# EAGLE design FenixCasePowerBoard (EAGLE 7.7.0)

## Sheet 1 of 3
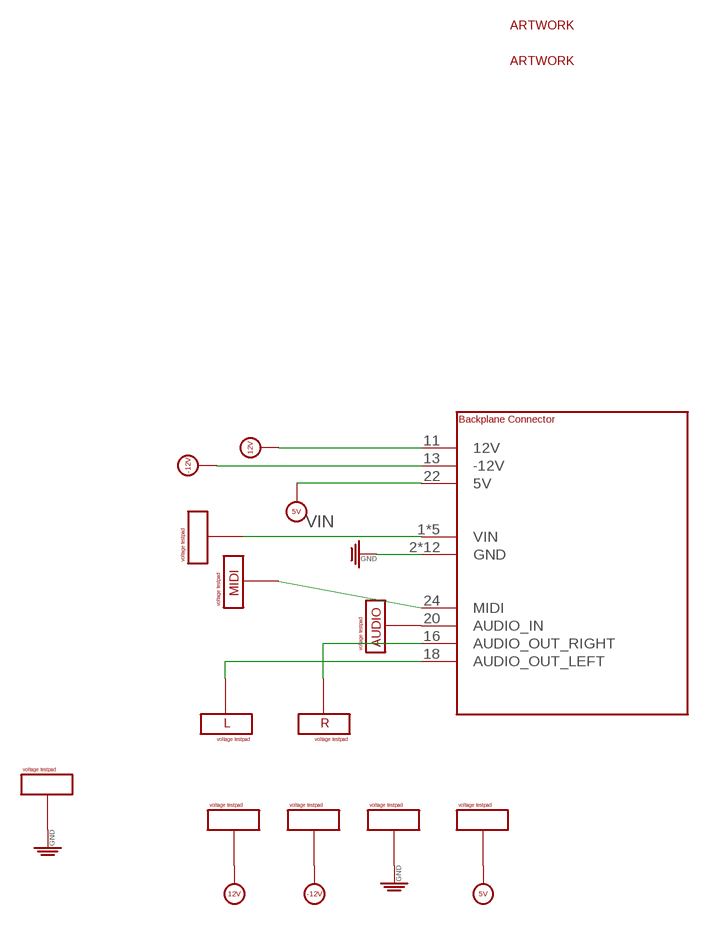
[diagram p0: schematic, sheet 1]

### Parts
U$1  VOLTAGETESTPAD  [POWERTESTPAD]
U$2  VOLTAGETESTPAD  [POWERTESTPAD]
U$4  VOLTAGETESTPAD_BIG  [POWERTESTPAD_BIG]
U$6  VOLTAGETESTPAD_BIG  [POWERTESTPAD_BIG]
U$7  VOLTAGETESTPAD_BIG  [POWERTESTPAD_BIG]
U$8  BACKPLANECONNECTOR_VINPLANE  [BACKPLANECONNECTOR]
U$12  VOLTAGETESTPAD_BIG  [POWERTESTPAD_BIG]
U$20  TINRS_ARTWORKTINYDATE  [JUSTATINYROCKET_DATECODE]
U$21  TINRS_ARTWORKTINYDATE  [JUSTATINYROCKET_DATECODE]
U$29  VOLTAGETESTPAD  [POWERTESTPAD]
U$30  VOLTAGETESTPAD  [POWERTESTPAD]
U$104  VOLTAGETESTPAD_BIG  [POWERTESTPAD_BIG]
U$105  VOLTAGETESTPAD_BIG  [POWERTESTPAD_BIG]

### Nets
5V [power]: U$7.P$1(VOLTAGE) U$7.P$2(VOLTAGE) U$7.P$3(VOLTAGE) U$8.22(5V) ; also sheet 3
12V [power]: U$8.11(12V) U$12.P$1(VOLTAGE) U$12.P$2(VOLTAGE) U$12.P$3(VOLTAGE) ; also sheet 3
-12V [power]: U$4.P$1(VOLTAGE) U$4.P$2(VOLTAGE) U$4.P$3(VOLTAGE) U$8.13(-12V) ; also sheet 3
AUDIO_OUT_LEFT_TIP: U$8.18(AUDIO_OUT_LEFT) U$29.P$1(VOLTAGE) U$29.P$2(VOLTAGE) U$29.P$3(VOLTAGE)
AUDIO_OUT_RIGHT_TIP: U$8.16(AUDIO_OUT_RIGHT) U$30.P$1(VOLTAGE) U$30.P$2(VOLTAGE) U$30.P$3(VOLTAGE)
GND [power]: U$6.P$1(VOLTAGE) U$6.P$2(VOLTAGE) U$6.P$3(VOLTAGE) U$8.2(GND) U$8.4(GND) U$8.6(GND) U$8.8(GND) U$8.10(GND) U$8.12(GND) U$8.14(GND) U$8.15(GND) U$8.17(GND) U$8.19(GND) U$8.21(GND) U$8.23(GND) U$105.P$1(VOLTAGE) U$105.P$2(VOLTAGE) U$105.P$3(VOLTAGE) ; also sheet 3
N$1: U$1.P$1(VOLTAGE) U$1.P$2(VOLTAGE) U$1.P$3(VOLTAGE) U$8.24(MIDI)
N$2: U$2.P$1(VOLTAGE) U$2.P$2(VOLTAGE) U$2.P$3(VOLTAGE) U$8.20(AUDIO_IN)
VIN [power]: U$8.1(VIN) U$8.3(VIN) U$8.5(VIN) U$8.7(VIN) U$8.9(VIN) U$104.P$1(VOLTAGE) U$104.P$2(VOLTAGE) U$104.P$3(VOLTAGE) ; also sheet 3

## Sheet 2 of 3: Serial Lines

## Sheet 3 of 3: Power
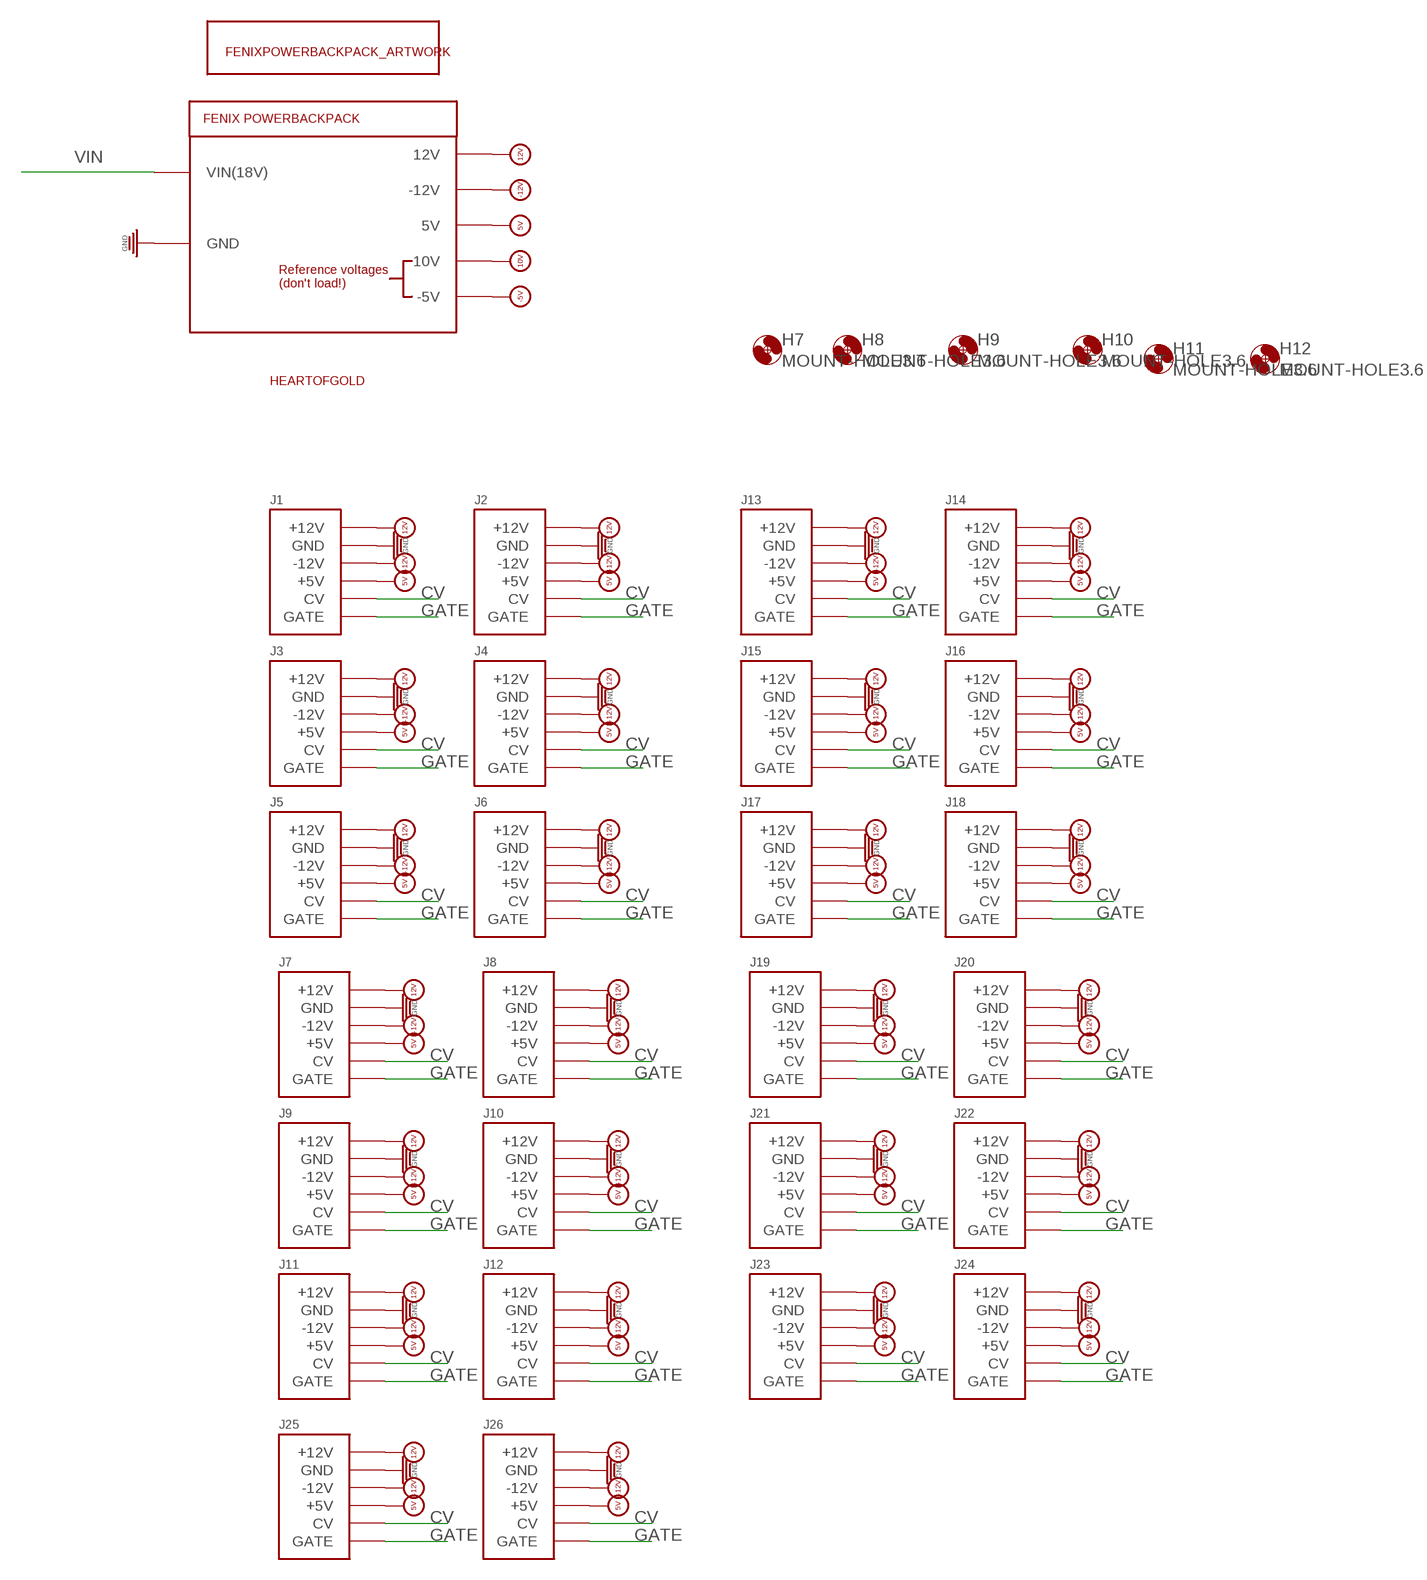
[diagram p1: schematic, sheet 3]

### Parts
H7  MOUNT-HOLE3.6  [3,6]
H8  MOUNT-HOLE3.6  [3,6]
H9  MOUNT-HOLE3.6  [3,6]
H10  MOUNT-HOLE3.6  [3,6]
H11  MOUNT-HOLE3.6  [3,6]
H12  MOUNT-HOLE3.6  [3,6]
J1  POWERSHROUDED  [POWER_16_SHROUDED]
J2  POWERSHROUDED  [POWER_16_SHROUDED]
J3  POWERSHROUDED  [POWER_16_SHROUDED]
J4  POWERSHROUDED  [POWER_16_SHROUDED]
J5  POWERSHROUDED  [POWER_16_SHROUDED]
J6  POWERSHROUDED  [POWER_16_SHROUDED]
J7  POWERSHROUDED  [POWER_16_SHROUDED]
J8  POWERSHROUDED  [POWER_16_SHROUDED]
J9  POWERSHROUDED  [POWER_16_SHROUDED]
J10  POWERSHROUDED  [POWER_16_SHROUDED]
J11  POWERSHROUDED  [POWER_16_SHROUDED]
J12  POWERSHROUDED  [POWER_16_SHROUDED]
J13  POWERSHROUDED  [POWER_16_SHROUDED]
J14  POWERSHROUDED  [POWER_16_SHROUDED]
J15  POWERSHROUDED  [POWER_16_SHROUDED]
J16  POWERSHROUDED  [POWER_16_SHROUDED]
J17  POWERSHROUDED  [POWER_16_SHROUDED]
J18  POWERSHROUDED  [POWER_16_SHROUDED]
J19  POWERSHROUDED  [POWER_16_SHROUDED]
J20  POWERSHROUDED  [POWER_16_SHROUDED]
J21  POWERSHROUDED  [POWER_16_SHROUDED]
J22  POWERSHROUDED  [POWER_16_SHROUDED]
J23  POWERSHROUDED  [POWER_16_SHROUDED]
J24  POWERSHROUDED  [POWER_16_SHROUDED]
J25  POWERSHROUDED  [POWER_16_SHROUDED]
J26  POWERSHROUDED  [POWER_16_SHROUDED]
U$5  FENIXPOWERBACKPACKART_MODULE  [FENIXPOWERBACKPACK_MODULE]
U$10  HEARTOFGOLD  [HEARTOFGOLD]
U$31  FENIXPOWERBACKPACK_MODULE  [FENIXPOWERBACKPACK]

### Nets
5V [power]: J1.11(+5V) J1.12(+5V) J2.11(+5V) J2.12(+5V) J3.11(+5V) J3.12(+5V) J4.11(+5V) J4.12(+5V) J5.11(+5V) J5.12(+5V) J6.11(+5V) J6.12(+5V) J7.11(+5V) J7.12(+5V) J8.11(+5V) J8.12(+5V) J9.11(+5V) J9.12(+5V) J10.11(+5V) J10.12(+5V) J11.11(+5V) J11.12(+5V) J12.11(+5V) J12.12(+5V) J13.11(+5V) J13.12(+5V) J14.11(+5V) J14.12(+5V) J15.11(+5V) J15.12(+5V) J16.11(+5V) J16.12(+5V) J17.11(+5V) J17.12(+5V) J18.11(+5V) J18.12(+5V) J19.11(+5V) J19.12(+5V) J20.11(+5V) J20.12(+5V) J21.11(+5V) J21.12(+5V) J22.11(+5V) J22.12(+5V) J23.11(+5V) J23.12(+5V) J24.11(+5V) J24.12(+5V) J25.11(+5V) J25.12(+5V) J26.11(+5V) J26.12(+5V) U$31.5V@1(5V) U$31.5V@2(5V) U$31.5V@3(5V) U$31.5V@4(5V) ; also sheet 1
10V [power]: U$31.10V U$31.10V@2(10V)
12V [power]: J1.9(+12V) J1.10(+12V) J2.9(+12V) J2.10(+12V) J3.9(+12V) J3.10(+12V) J4.9(+12V) J4.10(+12V) J5.9(+12V) J5.10(+12V) J6.9(+12V) J6.10(+12V) J7.9(+12V) J7.10(+12V) J8.9(+12V) J8.10(+12V) J9.9(+12V) J9.10(+12V) J10.9(+12V) J10.10(+12V) J11.9(+12V) J11.10(+12V) J12.9(+12V) J12.10(+12V) J13.9(+12V) J13.10(+12V) J14.9(+12V) J14.10(+12V) J15.9(+12V) J15.10(+12V) J16.9(+12V) J16.10(+12V) J17.9(+12V) J17.10(+12V) J18.9(+12V) J18.10(+12V) J19.9(+12V) J19.10(+12V) J20.9(+12V) J20.10(+12V) J21.9(+12V) J21.10(+12V) J22.9(+12V) J22.10(+12V) J23.9(+12V) J23.10(+12V) J24.9(+12V) J24.10(+12V) J25.9(+12V) J25.10(+12V) J26.9(+12V) J26.10(+12V) U$31.12V@1(12V) U$31.12V@2(12V) U$31.12V@4(12V) ; also sheet 1
-5V [power]: U$31.-5V U$31.-5V@2(-5V)
-12V [power]: J1.1(-12V) J1.2(-12V) J2.1(-12V) J2.2(-12V) J3.1(-12V) J3.2(-12V) J4.1(-12V) J4.2(-12V) J5.1(-12V) J5.2(-12V) J6.1(-12V) J6.2(-12V) J7.1(-12V) J7.2(-12V) J8.1(-12V) J8.2(-12V) J9.1(-12V) J9.2(-12V) J10.1(-12V) J10.2(-12V) J11.1(-12V) J11.2(-12V) J12.1(-12V) J12.2(-12V) J13.1(-12V) J13.2(-12V) J14.1(-12V) J14.2(-12V) J15.1(-12V) J15.2(-12V) J16.1(-12V) J16.2(-12V) J17.1(-12V) J17.2(-12V) J18.1(-12V) J18.2(-12V) J19.1(-12V) J19.2(-12V) J20.1(-12V) J20.2(-12V) J21.1(-12V) J21.2(-12V) J22.1(-12V) J22.2(-12V) J23.1(-12V) J23.2(-12V) J24.1(-12V) J24.2(-12V) J25.1(-12V) J25.2(-12V) J26.1(-12V) J26.2(-12V) U$31.-12V@1(-12V) U$31.-12V@2(-12V) U$31.-12V@3(-12V) ; also sheet 1
CV: J1.13(CV) J1.14(CV) J2.13(CV) J2.14(CV) J3.13(CV) J3.14(CV) J4.13(CV) J4.14(CV) J5.13(CV) J5.14(CV) J6.13(CV) J6.14(CV) J7.13(CV) J7.14(CV) J8.13(CV) J8.14(CV) J9.13(CV) J9.14(CV) J10.13(CV) J10.14(CV) J11.13(CV) J11.14(CV) J12.13(CV) J12.14(CV) J13.13(CV) J13.14(CV) J14.13(CV) J14.14(CV) J15.13(CV) J15.14(CV) J16.13(CV) J16.14(CV) J17.13(CV) J17.14(CV) J18.13(CV) J18.14(CV) J19.13(CV) J19.14(CV) J20.13(CV) J20.14(CV) J21.13(CV) J21.14(CV) J22.13(CV) J22.14(CV) J23.13(CV) J23.14(CV) J24.13(CV) J24.14(CV) J25.13(CV) J25.14(CV) J26.13(CV) J26.14(CV)
GATE: J1.15(GATE) J1.16(GATE) J2.15(GATE) J2.16(GATE) J3.15(GATE) J3.16(GATE) J4.15(GATE) J4.16(GATE) J5.15(GATE) J5.16(GATE) J6.15(GATE) J6.16(GATE) J7.15(GATE) J7.16(GATE) J8.15(GATE) J8.16(GATE) J9.15(GATE) J9.16(GATE) J10.15(GATE) J10.16(GATE) J11.15(GATE) J11.16(GATE) J12.15(GATE) J12.16(GATE) J13.15(GATE) J13.16(GATE) J14.15(GATE) J14.16(GATE) J15.15(GATE) J15.16(GATE) J16.15(GATE) J16.16(GATE) J17.15(GATE) J17.16(GATE) J18.15(GATE) J18.16(GATE) J19.15(GATE) J19.16(GATE) J20.15(GATE) J20.16(GATE) J21.15(GATE) J21.16(GATE) J22.15(GATE) J22.16(GATE) J23.15(GATE) J23.16(GATE) J24.15(GATE) J24.16(GATE) J25.15(GATE) J25.16(GATE) J26.15(GATE) J26.16(GATE)
GND [power]: J1.3(GND) J1.4(GND) J1.5(GND) J1.6(GND) J1.7(GND) J1.8(GND) J2.3(GND) J2.4(GND) J2.5(GND) J2.6(GND) J2.7(GND) J2.8(GND) J3.3(GND) J3.4(GND) J3.5(GND) J3.6(GND) J3.7(GND) J3.8(GND) J4.3(GND) J4.4(GND) J4.5(GND) J4.6(GND) J4.7(GND) J4.8(GND) J5.3(GND) J5.4(GND) J5.5(GND) J5.6(GND) J5.7(GND) J5.8(GND) J6.3(GND) J6.4(GND) J6.5(GND) J6.6(GND) J6.7(GND) J6.8(GND) J7.3(GND) J7.4(GND) J7.5(GND) J7.6(GND) J7.7(GND) J7.8(GND) J8.3(GND) J8.4(GND) J8.5(GND) J8.6(GND) J8.7(GND) J8.8(GND) J9.3(GND) J9.4(GND) J9.5(GND) J9.6(GND) J9.7(GND) J9.8(GND) J10.3(GND) J10.4(GND) J10.5(GND) J10.6(GND) J10.7(GND) J10.8(GND) J11.3(GND) J11.4(GND) J11.5(GND) J11.6(GND) J11.7(GND) J11.8(GND) J12.3(GND) J12.4(GND) J12.5(GND) J12.6(GND) J12.7(GND) J12.8(GND) J13.3(GND) J13.4(GND) J13.5(GND) J13.6(GND) J13.7(GND) J13.8(GND) J14.3(GND) J14.4(GND) J14.5(GND) J14.6(GND) J14.7(GND) J14.8(GND) J15.3(GND) J15.4(GND) J15.5(GND) J15.6(GND) J15.7(GND) J15.8(GND) J16.3(GND) J16.4(GND) J16.5(GND) J16.6(GND) J16.7(GND) J16.8(GND) J17.3(GND) J17.4(GND) J17.5(GND) J17.6(GND) J17.7(GND) J17.8(GND) J18.3(GND) J18.4(GND) J18.5(GND) J18.6(GND) J18.7(GND) J18.8(GND) J19.3(GND) J19.4(GND) J19.5(GND) J19.6(GND) J19.7(GND) J19.8(GND) J20.3(GND) J20.4(GND) J20.5(GND) J20.6(GND) J20.7(GND) J20.8(GND) J21.3(GND) J21.4(GND) J21.5(GND) J21.6(GND) J21.7(GND) J21.8(GND) J22.3(GND) J22.4(GND) J22.5(GND) J22.6(GND) J22.7(GND) J22.8(GND) J23.3(GND) J23.4(GND) J23.5(GND) J23.6(GND) J23.7(GND) J23.8(GND) J24.3(GND) J24.4(GND) J24.5(GND) J24.6(GND) J24.7(GND) J24.8(GND) J25.3(GND) J25.4(GND) J25.5(GND) J25.6(GND) J25.7(GND) J25.8(GND) J26.3(GND) J26.4(GND) J26.5(GND) J26.6(GND) J26.7(GND) J26.8(GND) U$31.GND@1(GND) U$31.GND@2(GND) U$31.GND@3(GND) U$31.GND@4(GND) U$31.GND@5(GND) U$31.GND@6(GND) U$31.GND@7(GND) U$31.GND@8(GND) U$31.GND@9(GND) U$31.GND@10(GND) U$31.GND@11(GND) U$31.GND@12(GND) U$31.GND@13(GND) U$31.GND@14(GND) ; also sheet 1
VIN [power]: U$31.VIN@1(VIN(18V)) U$31.VIN@2(VIN(18V)) U$31.VIN@3(VIN(18V)) U$31.VIN@4(VIN(18V)) ; also sheet 1

## Library data of the parts
H7-H12 = zephod-components:MOUNT-HOLE: MOUNTING HOLE with drill center marker
J1-J26 = EurorackModularParts:POWER
U$1 = FenixBase:VOLTAGETESTPAD; DESC: MIDI
U$2 = FenixBase:VOLTAGETESTPAD; DESC: AUDIO
U$4 = FenixBase:VOLTAGETESTPAD; DESC: -12V
U$5 = EurorackModularParts:FENIXPOWERBACKPACKART
U$6 U$105 = FenixBase:VOLTAGETESTPAD; DESC: GND
U$7 = FenixBase:VOLTAGETESTPAD; DESC: 5V
U$8 = FenixBase:BACKPLANECONNECTOR_VIN; DESC: PowerSupplyInput
U$10 = FenixBase:HEARTOFGOLD
U$12 = FenixBase:VOLTAGETESTPAD; DESC: 12V
U$20 U$21 = EurorackModularParts:TINRS_ARTWORK
U$29 = FenixBase:VOLTAGETESTPAD; DESC: L
U$30 = FenixBase:VOLTAGETESTPAD; DESC: R
U$31 = EurorackModularParts:FENIXPOWERBACKPACK
U$104 = FenixBase:VOLTAGETESTPAD; DESC: VIN

## Net classes
0 default: width 0.254 mm
1 power: width 1.27 mm, clearance 0.203 mm

## Board
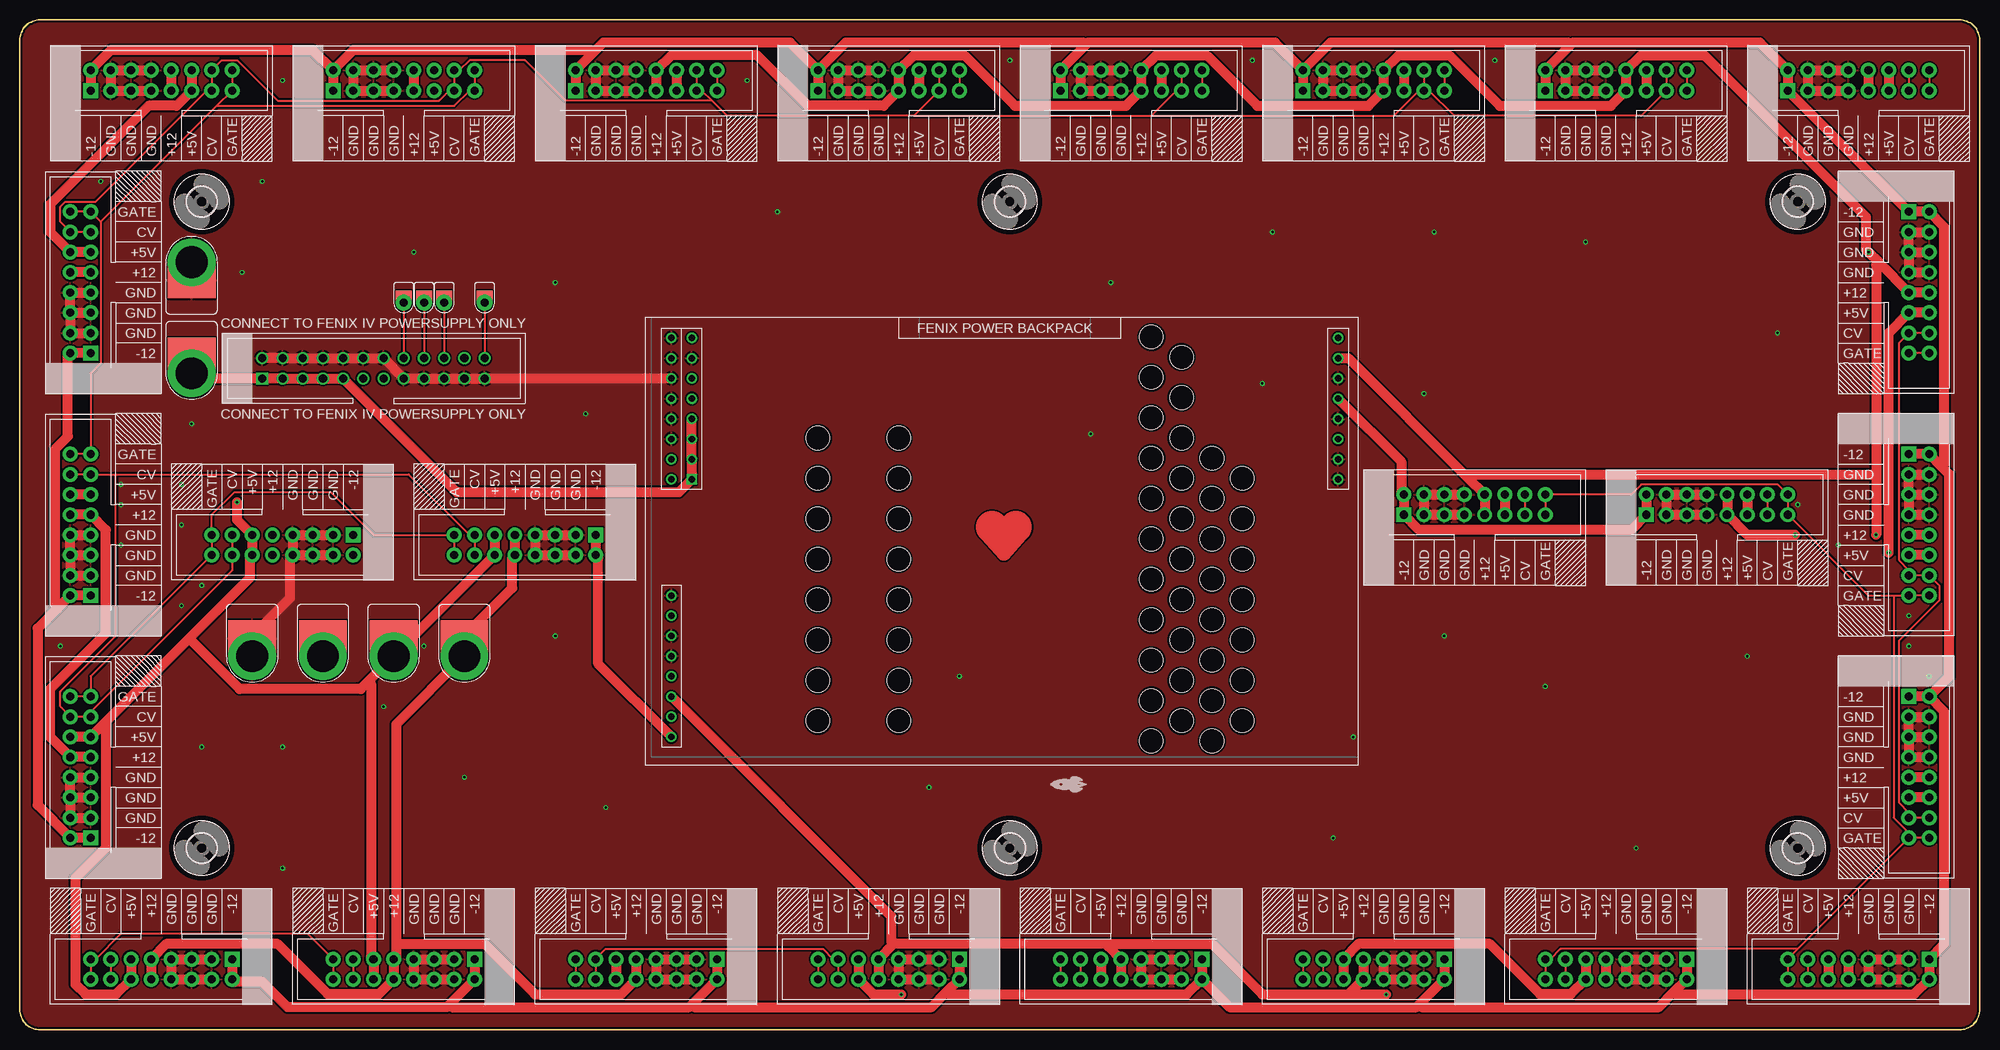
[diagram p2: board, top side]
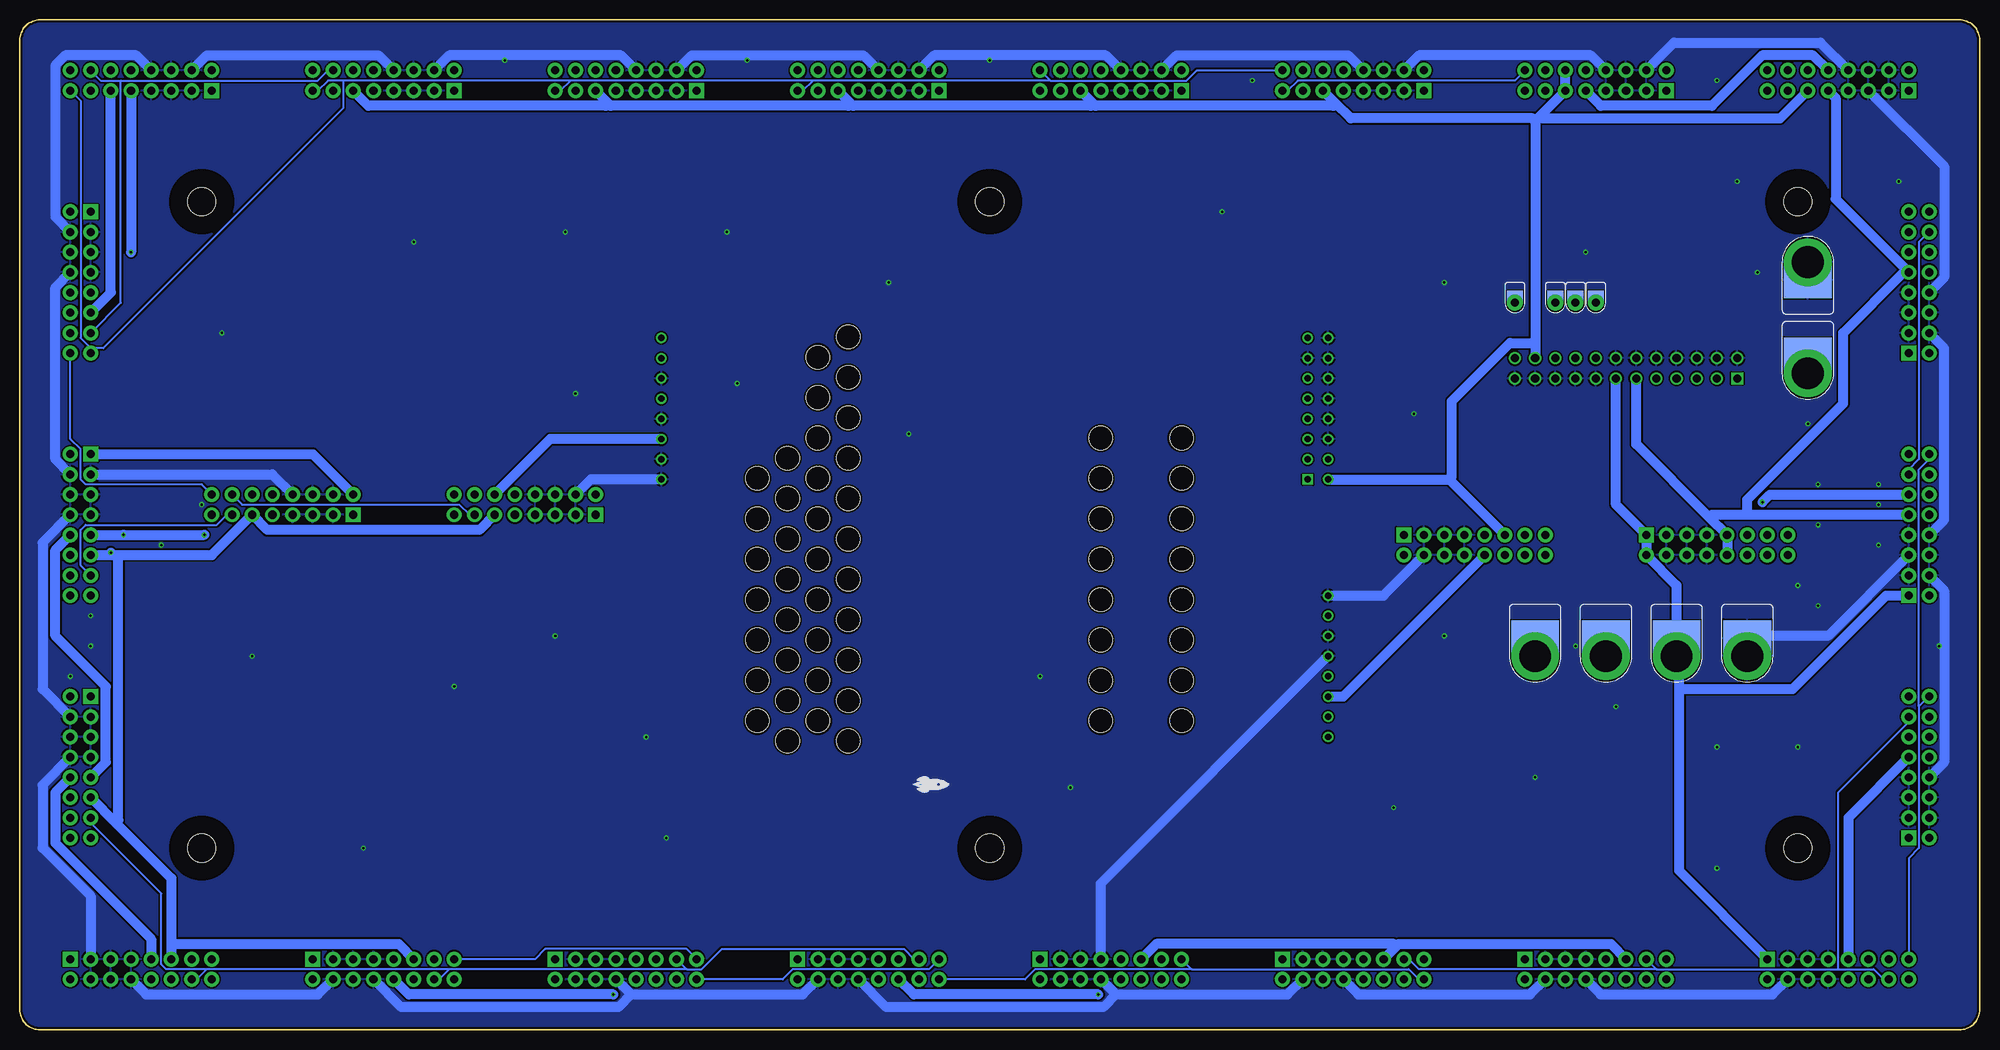
[diagram p3: board, bottom side, seen from below]

Size 246.38 x 127 mm. Coordinates in mm from the lower left corner, seen from the top.
Outline: 246.38,2.54 246.38,124.46 arc90 243.84,127 2.54,127 arc90 0,124.46 0,2.54 arc90 2.54,0 243.84,0 arc90 246.38,2.54
Copper layers (1*16): Top 0.035mm / dielectric 1.5mm / Bottom 0.035mm
Design rules "ITEADstudio_DRC *": minimum track width 6mil, minimum drill 12mil, track to track 6mil, track to pad 6mil, pad to pad 6mil, via to via 6mil, smd to smd 0mil, copper to edge 10mil, drill to drill 10mil, minimum pad ring 10mil, minimum via ring 6mil, stop-mask expansion 2mil, vias tented up to drill 100mil, thermal gap 10mil
Holes 3 mm at 153.67,64.26 149.86,61.72 149.86,56.64 142.24,51.56 153.67,59.18 153.67,54.1 153.67,49.02 149.86,46.48 146.05,54.1 149.86,51.56 142.24,46.48 146.05,49.02 146.05,59.18 146.05,64.26 142.24,61.72 142.24,56.64 100.33,74.42 100.33,69.34 100.33,64.26 110.49,74.42 110.49,69.34 110.49,64.26 110.49,49.02 110.49,43.94 110.49,38.86 100.33,49.02 100.33,43.94 100.33,38.86 149.86,66.8 142.24,66.8 146.05,69.34 142.24,71.88 142.24,76.96 142.24,82.04 142.24,87.12 146.05,74.42 146.05,79.5 146.05,84.58 153.67,43.94 153.67,38.86 149.86,41.4 146.05,43.94 142.24,41.4 146.05,38.86 149.86,36.32 142.24,36.32 149.86,71.88 153.67,69.34 110.49,54.1 110.49,59.18 100.33,54.1 100.33,59.18

### Footprints (pad centres in the part's own frame; a part is rotated, then mirrored left to right if it is on the bottom)
3,6 = hole 3.6: 0,0
POWER_16_SHROUDED = drill 1.016 pad 1.88 square: 1 -8.89,-1.27 | drill 1.016 pad 1.88: 2 -8.89,1.27; 3 -6.35,-1.27; 4 -6.35,1.27; 5 -3.81,-1.27; 6 -3.81,1.27; 7 -1.27,-1.27; 8 -1.27,1.27; 9 1.27,-1.27; 10 1.27,1.27; 11 3.81,-1.27; 12 3.81,1.27; 13 6.35,-1.27; 14 6.35,1.27; 15 8.89,-1.27; 16 8.89,1.27
POWERTESTPAD = drill 1 pad 2: P$1 0,0 | smd 2 x 1.5: P$2 0,-0.75 | smd 2 x 1.5 bottom: P$3 0,-0.75
POWERTESTPAD_BIG = drill 4 pad 6: P$1 0,0 | smd 6 x 4.5: P$2 0,-2.25 | smd 6 x 4.5 bottom: P$3 0,-2.25
BACKPLANECONNECTOR = drill 1.016 square: 1 -13.97,-1.27 | drill 1.016: 2 -13.97,1.27; 3 -11.43,-1.27; 4 -11.43,1.27; 5 -8.89,-1.27; 6 -8.89,1.27; 7 -6.35,-1.27; 8 -6.35,1.27; 9 -3.81,-1.27; 10 -3.81,1.27; 11 -1.27,-1.27; 12 -1.27,1.27; 13 1.27,-1.27; 14 1.27,1.27; 15 3.81,-1.27; 16 3.81,1.27; 17 6.35,-1.27; 18 6.35,1.27; 19 8.89,-1.27; 20 8.89,1.27; 21 11.43,-1.27; 22 11.43,1.27; 23 13.97,-1.27; 24 13.97,1.27
FENIXPOWERBACKPACK = drill 0.8: 5V@1 2.54,44.45; 5V@2 86.36,46.99; 5V@3 2.54,24.765; 5V@4 2.54,41.91; 10V 86.36,59.69; 10V@2 2.54,17.145; 12V@1 86.36,57.15; 12V@2 5.08,52.07; 12V@4 2.54,14.605; -5V 5.08,59.69; -5V@2 2.54,12.065; -12V@1 86.36,52.07; -12V@2 5.08,54.61; -12V@3 2.54,9.525; GND@1 2.54,22.225; GND@2 5.08,57.15; GND@3 2.54,46.99; GND@4 2.54,49.53; GND@5 86.36,54.61; GND@6 2.54,52.07; GND@7 86.36,49.53; GND@8 2.54,54.61; GND@9 2.54,57.15; GND@10 2.54,59.69; GND@11 86.36,44.45; GND@12 86.36,41.91; GND@13 2.54,19.685; GND@14 2.54,27.305; VIN@2 5.08,44.45; VIN@3 5.08,46.99; VIN@4 5.08,49.53 | drill 0.8 square: VIN@1 5.08,41.91

### Placement (x,y rotation side)
H7  22.86,104.14 0 top
H8  22.86,22.86 0 top
H9  124.46,22.86 0 top
H10  124.46,104.14 0 top
H11  223.52,104.14 0 top
H12  223.52,22.86 0 top
J1  78.74,119.38 0 top
J2  48.26,119.38 0 top
J3  17.78,119.38 0 top
J4  109.22,119.38 0 top
J5  139.7,119.38 0 top
J6  170.18,119.38 0 top
J7  200.66,119.38 0 top
J8  231.14,119.38 0 top
J9  238.76,93.98 270 top
J10  17.78,7.62 180 top
J11  78.74,7.62 180 top
J12  48.26,7.62 180 top
J13  182.88,66.04 0 top
J14  33.02,60.96 180 top
J15  63.5,60.96 180 top
J16  7.62,63.5 90 top
J17  7.62,93.98 90 top
J18  7.62,33.02 90 top
J19  238.76,33.02 270 top
J20  231.14,7.62 180 top
J21  200.66,7.62 180 top
J22  170.18,7.62 180 top
J23  139.7,7.62 180 top
J24  109.22,7.62 180 top
J25  213.36,66.04 0 top
J26  238.76,63.5 270 top
U$1  58.42,91.44 180 top
U$2  53.34,91.44 180 top
U$4  38.1,46.99 180 top
U$5  79.38,27.3 0 top
U$6  29.21,46.99 180 top
U$7  46.99,46.99 180 top
U$8  44.45,83.19 0 top
U$10  123.7,61.98 0 top
U$12  55.88,46.99 180 top
U$20  131.83,30.86 90 top
U$21  131.83,30.86 270 bottom
U$29  50.8,91.44 180 top
U$30  48.26,91.44 180 top
U$31  79.38,27.3 0 top
U$104  21.59,82.55 180 top
U$105  21.59,96.52 0 top

### Tracks (layer width: path | path; a pad name or v marks a point on that pad's centre or on a via)
5V  (via drill 0.3)
  Top 1.27: J17.11 J17.12 3.81,100.33 3.81,103.82 16.19,116.2 19.68,116.2 J3.11 J3.12 | J7.12 J7.11 | J6.12 J6.11 | J5.12 J5.11 | J4.12 J4.11 | J1.12 J1.11 | J8.12 J8.11 | J9.12 J9.11 234.95,87.63 v234.95,60.01 | J22.12 J22.11 168.27,10.8 184.78,10.8 191.13,4.45 194.94,4.45 J21.12 J21.11 | J25.12 J25.11 | J26.12 J26.11 | J20.11 J20.12 | J19.12 J19.11 | J23.11 J23.12 | J24.11 J24.12 107.31,4.45 v110.81,4.45 | J12.12 J12.11 44.13,9.21 44.13,43.5 43.81,43.81 | J11.11 J11.12 | J16.11 J16.12 | J10.11 J10.12 12.06,4.45 8.25,4.45 6.98,5.72 6.98,19.05 10.79,22.86 10.79,38.1 10.48,38.42 | J18.12 J18.11 10.48,38.42 | 21.27,49.21 28.89,56.83 28.89,59.37 J14.12 J14.11 27.3,64.14 v27.3,66.36 | 21.27,49.21 10.48,38.42 | J15.11 J15.12 U$7.P$1 43.81,43.81 | J13.12 J13.11 | 21.27,49.21 27.62,42.86 42.86,42.86 43.81,43.81
  Bottom 1.27: 55.88,114.3 55.88,86.36 | 55.88,86.36 U$8.22 | 55.24,114.94 J2.11 J2.12 | 55.24,114.94 55.88,114.3 | 80.96,116.52 79.06,114.62 56.2,114.62 55.88,114.3 | 80.96,116.52 J1.11 | 111.44,116.52 111.12,116.2 81.28,116.2 80.96,116.52 | 111.44,116.52 J4.11 | 141.92,116.52 141.6,116.2 111.76,116.2 111.44,116.52 | 141.92,116.52 J5.11 | 172.4,116.52 172.08,116.2 142.24,116.2 141.92,116.52 | 172.4,116.52 J6.11 | J7.11 202.56,116.2 172.72,116.2 172.4,116.52 | J3.11 25.08,114.62 54.93,114.62 55.24,114.94 | J8.11 234.95,92.71 J9.11 | J26.11 234.95,59.69 | 234.95,59.69 234,59.69 | 234,59.69 222.25,59.69 J25.11 215.26,62.87 188.59,62.87 J13.11 | 227.33,10.8 227.33,19.05 234.31,26.03 | 227.33,10.8 J20.11 | J19.11 234.31,26.03 | 234,59.69 234,26.35 234.31,26.03 | J21.11 198.75,10.8 227.33,10.8 | v234.95,60.01 234.95,59.69 | J12.11 46.35,10.8 73.02,10.8 73.34,10.48 | J11.11 73.34,10.48 | J24.11 103.5,10.8 73.66,10.8 73.34,10.48 | J23.12 133.98,4.45 v110.81,4.45 | J16.11 26.35,67.31 v27.3,66.36 | J13.12 179.7,74.3 U$31.5V@2 | 66.67,69.22 J15.11 | U$31.5V@4 66.67,69.22 | 55.88,86.36 59.05,86.36 66.36,79.06 66.36,69.53 66.67,69.22
12V  (via drill 0.3)
  Top 1.27: J25.10 J25.9 217.17,62.23 v223.2,62.23 | J26.10 J26.9 | J20.9 J20.10 | J19.10 J19.9 | J9.10 J9.9 233.68,96.52 | J8.10 J8.9 | 233.68,96.52 v232.41,97.79 232.09,98.11 232.09,102.23 211.77,122.56 203.83,122.56 J7.10 J7.9 200.02,116.2 186.06,116.2 179.7,122.56 173.35,122.56 J6.10 J6.9 169.54,116.2 155.57,116.2 149.22,122.56 142.88,122.56 J5.10 J5.9 139.06,116.2 125.09,116.2 118.74,122.56 112.39,122.56 J4.10 J4.9 108.58,116.2 99.06,116.2 92.71,122.56 81.91,122.56 J1.10 J1.9 | 233.36,69.85 233.36,96.2 233.68,96.52 | 233.36,69.85 v233.36,62.23 | J16.10 J16.9 10.79,62.87 10.79,49.85 3.81,42.86 3.81,36.83 J18.10 J18.9 | J2.10 J2.9 | J17.9 J17.10 | J3.10 J3.9 | J10.10 J10.9 18.41,10.8 32.38,10.8 38.73,4.45 45.08,4.45 J12.10 J12.9 47.31,9.21 47.31,10.8 | J15.9 J15.10 61.91,59.37 61.91,55.56 55.88,49.53 U$12.P$1 47.31,38.42 47.31,10.8 | J11.9 J11.10 75.56,4.45 64.77,4.45 58.42,10.8 47.31,10.8 | J21.9 J21.10 | J22.9 J22.10 167.32,4.76 | J24.10 J24.9 109.85,10.8 | J23.10 J23.9 136.84,10.48 | 109.85,10.8 136.53,10.8 136.84,10.48 | 167.32,4.76 167,4.45 156.21,4.45 149.86,10.8 137.16,10.8 136.84,10.48 | v171.77,4.45 167.64,4.45 167.32,4.76 | J13.9 J13.10 181.93,69.53 | 181.93,69.53 167,84.45 U$31.12V@1 | U$31.12V@4 109.54,14.29 109.54,11.11 109.85,10.8 | 233.36,69.85 182.25,69.85 181.93,69.53
  Bottom 1.27: J20.9 229.87,11.43 241.94,23.49 241.94,29.84 J19.10 | J26.10 241.94,60.33 241.94,49.53 235.58,43.18 235.58,33.66 J19.9 | J26.9 v233.36,62.23 v223.2,62.23 | J8.9 v232.41,97.79 | U$8.11 43.18,73.66 33.97,64.45 | 33.97,64.45 J14.9 J14.10 | 29.21,64.77 33.65,64.77 33.97,64.45 | 29.21,64.77 J16.9 | J3.9 18.1,117.16 18.1,104.46 J17.9 9.52,95.25 17.14,87.63 17.14,78.74 29.21,66.67 29.21,64.77 | J2.9 47.62,116.2 33.65,116.2 27.3,122.56 20.95,122.56 J3.10 | J10.9 16.51,26.67 J18.9 | J21.10 197.49,4.45 v171.77,4.45 | J15.10 80.01,41.91 U$31.12V@4
-12V
  Top 1.27: J3.1 J3.2 11.43,123.19 36.83,123.19 J2.2 | J2.2 J2.1 | J1.1 J1.2 72.07,122.87 | J4.2 J4.1 | 72.07,122.87 73.34,124.14 96.84,124.14 J4.2 | J2.2 41.91,123.19 71.75,123.19 72.07,122.87 | J5.1 J5.2 133.98,123.83 | J6.2 J6.1 | 133.98,123.83 134.3,124.14 157.8,124.14 J6.2 | J7.1 J7.2 194.94,123.83 | 194.94,123.83 195.26,124.14 218.76,124.14 J8.2 J8.1 J9.1 J9.2 241.94,100.97 241.94,71.12 241.62,70.8 | J6.2 164.78,124.14 194.63,124.14 194.94,123.83 | J4.2 103.82,124.14 133.67,124.14 133.98,123.83 | J15.1 J15.2 72.71,59.37 72.71,46.04 U$31.-12V@3 | U$31.-12V@1 173.67,71.44 173.67,67.63 J13.2 J13.1 175.89,62.87 202.56,62.87 J25.1 J25.2 | J17.1 J17.2 6.03,84.77 6.03,74.61 4.44,73.03 4.44,53.34 4.76,53.02 | J18.1 J18.2 2.22,28.26 2.22,50.48 4.76,53.02 | J16.1 J16.2 4.76,53.02 | J26.1 J26.2 241.62,70.8 | J19.2 J19.1 | J21.1 J21.2 207.96,4.76 | J22.1 J22.2 175.89,3.17 | J23.1 J23.2 | J24.1 J24.2 116.52,4.76 | J11.1 J11.2 84.45,3.17 | J10.1 J10.2 26.99,6.03 30.48,6.03 33.65,2.86 53.66,2.86 53.97,3.17 | J12.1 J12.2 53.97,3.17 | 84.45,3.17 84.14,2.86 54.29,2.86 53.97,3.17 | 116.52,4.76 114.62,2.86 84.77,2.86 84.45,3.17 | J23.2 146.69,4.45 116.84,4.45 116.52,4.76 | 175.89,3.17 175.58,2.86 152.08,2.86 J23.2 | 207.96,4.76 206.06,2.86 176.21,2.86 175.89,3.17 | 207.96,4.76 208.28,4.45 238.12,4.45 J20.2 J20.1 241.94,10.8 241.94,40 J19.2 | 241.62,70.8 242.57,69.85 242.57,44.45 J19.2
  Bottom 1.27: U$8.13 45.72,66.04 J14.1 J14.2 38.1,55.88 U$4.P$1 37.78,46.67 37.78,42.86 | J25.2 209.55,72.39 J26.1 | 37.78,42.86 37.78,20 J10.1 | J16.1 11.75,54.61 23.49,42.86 37.78,42.86
AUDIO_OUT_LEFT_TIP
  Top 0.254: U$29.P$1 U$8.18
AUDIO_OUT_RIGHT_TIP
  Top 0.254: U$30.P$1 U$8.16
CV
  Top 0.254: J15.14 J15.13 56.52,62.23 48.89,69.85 12.06,69.85 | J16.14 J16.13 12.06,69.85 | J17.13 J17.14 5.08,101.6 5.08,103.5 5.71,104.14 9.52,104.14 23.49,118.11 J3.13 J3.14 25.4,121.92 27.3,121.92 32.38,116.84 52.7,116.84 53.97,118.11 J2.13 J2.14 55.24,120.65 56.52,121.92 63.5,121.92 68.58,116.84 86.99,116.84 | J14.13 J14.14 26.67,57.78 8.89,40 J18.13 J18.14 5.08,40.64 5.08,42.55 12.06,49.53 12.06,69.85 | J24.14 J24.13 102.23,8.89 100.96,10.16 73.66,10.16 J11.13 J11.14 | J10.13 J10.14 | J12.13 J12.14 | J19.14 J19.13 237.49,27.3 236.22,28.58 236.22,48.89 241.3,53.98 241.3,55.88 J26.14 J26.13 237.49,57.78 236.22,59.05 236.22,86.36 J9.13 J9.14 | J20.13 J20.14 | J21.13 J21.14 | J23.13 J23.14 | J22.13 J22.14 | J6.14 J6.13 | J5.14 J5.13 145.41,118.11 142.24,114.94 | J1.14 J1.13 85.72,118.11 86.99,116.84 | J4.14 J4.13 112.39,114.94 | 86.99,116.84 88.9,114.94 112.39,114.94 | 112.39,114.94 142.24,114.94 | J6.13 175.89,118.11 172.72,114.94 142.24,114.94 | J7.14 J7.13 203.83,114.94 180.34,114.94 177.16,118.11 J6.13 | J8.14 J8.13 | J13.14 J13.13 | J25.14 J25.13
  Bottom 0.254: J16.13 8.89,70.48 7.62,71.75 7.62,99.06 J17.14 | J10.14 12.06,6.35 13.33,7.62 17.78,7.62 | 40.64,7.62 17.78,7.62 | J12.13 40.64,7.62 | J11.13 71.75,8.89 70.48,7.62 40.64,7.62 | J18.13 8.89,38.73 17.78,29.84 17.78,7.62 | J23.13 133.98,8.89 135.25,10.16 158.12,10.16 160.66,7.62 162.56,7.62 | J22.13 162.56,7.62 | J21.14 193.68,6.35 192.4,7.62 | 162.56,7.62 192.4,7.62 | J20.14 224.15,6.35 222.88,7.62 | 192.4,7.62 222.88,7.62 | J19.13 237.49,26.03 228.6,17.15 228.6,8.26 227.96,7.62 222.88,7.62 | J7.14 207.64,120.65 208.91,119.38 233.68,119.38 | 233.68,119.38 236.22,119.38 J8.14 | J13.13 189.87,64.77 191.13,66.04 218.44,66.04 J25.14 | J25.13 220.34,64.77 221.62,63.5 238.12,63.5 238.76,62.87 238.76,58.42 J26.13 | 233.68,119.38 233.68,91.44 J9.13
GATE
  Top 0.254: J21.16 J21.15 192.4,8.89 193.68,10.16 223.52,10.16 | J22.15 J22.16 | J23.15 J23.16 | J11.15 J11.16 | J24.15 J24.16 | J9.16 J9.15 | J8.16 J8.15 | J20.16 J20.15 223.52,10.16 | J19.16 J19.15 | J19.15 223.52,10.16 | J26.16 J26.15 235.58,54.61 | J13.15 J13.16 202.56,67.31 203.83,68.58 220.98,68.58 J25.16 J25.15 232.41,54.61 235.58,54.61 | J19.15 237.49,24.77 235.58,26.67 235.58,54.61 | J7.16 J7.15 | J6.16 J6.15 | J5.16 J5.15 | J1.16 J1.15 | J4.16 J4.15 | J2.16 J2.15 56.52,118.11 54.61,116.2 24.77,116.2 | J3.16 J3.15 24.77,116.2 | J16.16 J16.15 8.89,82.55 10.16,83.82 10.16,101.6 | J17.16 J17.15 10.16,101.6 | 10.16,101.6 24.77,116.2 | J10.16 J10.15 9.52,8.89 12.7,12.06 36.19,12.06 J12.15 J12.16 | J15.16 J15.15 44.45,62.23 39.05,67.63 26.99,67.63 24.13,64.77 J14.15 J14.16 8.89,44.45 J18.15 J18.16
  Bottom 0.254: J11.16 70.48,6.35 71.75,7.62 99.06,7.62 | J24.15 99.06,7.62 | J23.16 120.01,6.35 118.74,7.62 99.06,7.62 | J22.16 150.5,6.35 149.22,7.62 132.08,7.62 J23.15 | J21.15 181.61,8.89 180.34,10.16 162.56,10.16 J22.15 | 237.49,85.72 238.76,87 238.76,116.84 J8.15 | J9.16 240.03,74.3 238.76,73.03 238.76,69.22 238.12,68.58 223.52,68.58 J25.16 | J1.16 98.42,120.65 99.69,119.38 116.84,119.38 | J4.16 116.84,119.38 | J5.15 147.95,118.11 146.69,119.38 | 116.84,119.38 146.69,119.38 | J6.15 178.44,118.11 177.16,119.38 | 146.69,119.38 177.16,119.38 | J7.15 208.91,118.11 207.64,119.38 205.74,119.38 | 177.16,119.38 205.74,119.38 | J10.15 8.89,21.59 7.62,22.86 7.62,40.64 | J18.16 7.62,40.64 | J16.16 6.35,71.75 7.62,70.48 7.62,40.64 | J1.15 86.99,118.11 85.72,119.38 58.42,119.38 J2.16 | 237.49,85.72 235.9,85.72 205.74,115.89 205.74,119.38 | 237.49,85.72 J9.15
GND  (via drill 0.3)
  Top 1.27: U$8.2 U$8.4 U$8.6 U$8.8 U$8.10 U$8.12 U$8.14 U$8.15 U$8.17 U$8.19 U$8.21 U$8.23 U$31.GND@8 | J13.7 J13.5 J13.3 J13.4 J13.6 J13.8 | J15.4 J15.6 J15.8 J15.7 J15.5 J15.3 | J21.4 J21.6 J21.8 J21.7 J21.5 J21.3 | J20.4 J20.6 J20.8 J20.7 J20.5 J20.3 | J9.5 J9.7 J9.8 | J9.5 J9.3 J9.4 | J9.5 J9.6 | J19.5 J19.7 J19.8 | J19.5 J19.3 J19.4 | J19.5 J19.6 | J25.7 J25.5 J25.3 J25.4 J25.6 J25.8 | J26.5 J26.7 J26.8 | J26.5 J26.6 | J26.5 J26.3 J26.4 | J23.4 J23.6 J23.8 J23.7 J23.5 J23.3 | J22.4 J22.6 J22.8 J22.7 J22.5 J22.3 | J10.4 J10.6 J10.8 J10.7 J10.5 J10.3 | J12.4 J12.6 J12.8 J12.7 J12.5 J12.3 | J11.4 J11.6 J11.8 J11.7 J11.5 J11.3 | J24.4 J24.6 J24.8 J24.7 J24.5 J24.3 | J14.8 J14.7 J14.5 J14.3 | J14.8 J14.6 J14.4 | J14.8 33.97,59.37 33.97,54.29 29.21,49.53 U$6.P$1 | J17.6 J17.4 J17.3 | J17.6 J17.5 | J17.6 J17.8 J17.7 | J18.6 J18.4 J18.3 | J18.6 J18.8 J18.7 | J18.6 J18.5 | J16.6 J16.4 J16.3 | J16.6 J16.5 | J16.6 J16.8 J16.7 | J7.7 J7.5 J7.3 J7.4 J7.6 J7.8 | J8.7 J8.5 J8.3 J8.4 J8.6 J8.8 | J5.7 J5.5 J5.3 J5.4 J5.6 J5.8 | J6.7 J6.5 J6.3 J6.4 J6.6 J6.8 | J1.7 J1.5 J1.3 J1.4 J1.6 J1.8 | J4.7 J4.5 J4.3 J4.4 J4.6 J4.8 | J3.7 J3.5 J3.3 J3.4 J3.6 J3.8 | J2.7 J2.5 J2.3 J2.4 J2.6 J2.8
  Bottom 1.27: J15.4 74.93,54.61 U$31.GND@14 | J13.4 174.62,69.22 U$31.GND@12 | J21.4 208.91,4.45 230.5,4.45 J20.8 | J25.8 214.63,69.85 J26.3 | J19.4 243.52,42.86 243.52,61.28 J26.8 | J9.8 241.94,93.34 241.94,71.75 J26.4 | J20.3 237.49,16.83 243.52,22.86 243.52,30.8 J19.8 | J23.4 147.95,4.45 169.54,4.45 | J22.8 169.54,4.45 | J10.4 26.03,4.45 47.62,4.45 J12.8 | J11.4 86.99,4.45 108.58,4.45 | J24.8 108.58,4.45 | J12.4 56.52,4.45 78.1,4.45 J11.8 | J23.8 137.48,2.86 110.17,2.86 108.58,4.45 | J21.8 198.44,2.86 171.13,2.86 169.54,4.45 | U$31.GND@13 110.49,18.41 J24.7 | J18.8 4.44,33.66 4.44,55.24 J16.4 | J17.4 4.44,85.72 4.44,64.14 J16.8 | J16.5 19.05,49.53 29.21,49.53 U$6.P$1 | J7.8 201.29,122.56 222.88,122.56 J8.4 | J5.8 140.33,122.56 161.93,122.56 J6.4 | J1.8 79.38,122.56 100.96,122.56 J4.4 | J3.8 20,124.14 38.42,124.14 J2.4 | J1.4 70.48,122.56 48.89,122.56 J2.8 | J5.4 131.44,122.56 109.85,122.56 J4.8 | J7.4 192.4,122.56 170.81,122.56 J6.8 | J17.8 4.44,94.61 4.44,108.59 J3.5 | J9.4 241.94,102.23 241.94,121.28 240.66,122.56 231.77,122.56 J8.8
  other vias: 22.86,35.56 33.02,35.56 33.02,20.32 45.72,40.64 50.8,48.26 20.32,53.34 22.86,55.88 20.32,63.5 20.32,68.58 12.7,68.58 12.7,66.04 12.7,60.96 5.08,48.26 33.02,119.38 10.16,106.68 124.46,121.92 91.44,119.38 185.42,121.92 154.94,121.92 223.52,66.04 228.6,60.96 237.49,52.07 237.49,48.26 240.03,44.45 220.98,87.63 196.85,99.06 157.48,100.33 176.53,80.01 156.21,81.28 134.62,74.93 118.11,44.45 167.64,36.83 217.17,46.99 191.77,43.18 179.07,49.53 165.1,24.13 203.2,22.86 114.3,30.48 55.88,31.75 67.31,49.53 73.66,27.94 71.12,77.47 67.31,93.98 49.53,97.79 27.94,95.25 30.48,106.68 95.25,102.87 137.16,93.98 177.8,100.33 21.59,76.2
  pour Bottom: -2.54,129.54 246.38,129.54 246.38,-2.54 -2.54,-2.54
  pour Top: -2.54,129.54 246.38,129.54 246.38,-2.54 -2.54,-2.54
N$1
  Top 0.254: U$1.P$1 U$8.24
N$2
  Top 0.254: U$2.P$1 U$8.20
VIN
  Top 1.27: U$31.VIN@4 U$31.VIN@3 U$31.VIN@2 U$31.VIN@1 82.87,67.63 54.93,67.63 U$8.9 U$8.7 U$8.5 U$8.3 U$8.1 24.47,81.91 U$104.P$2

### Text on the board
tDocu: 388 x 288 mm